# EAGLE design Addon-mapleCUx_HM-RFM69-012 (EAGLE 7.3.0)
MAPLE-CUx Large Version
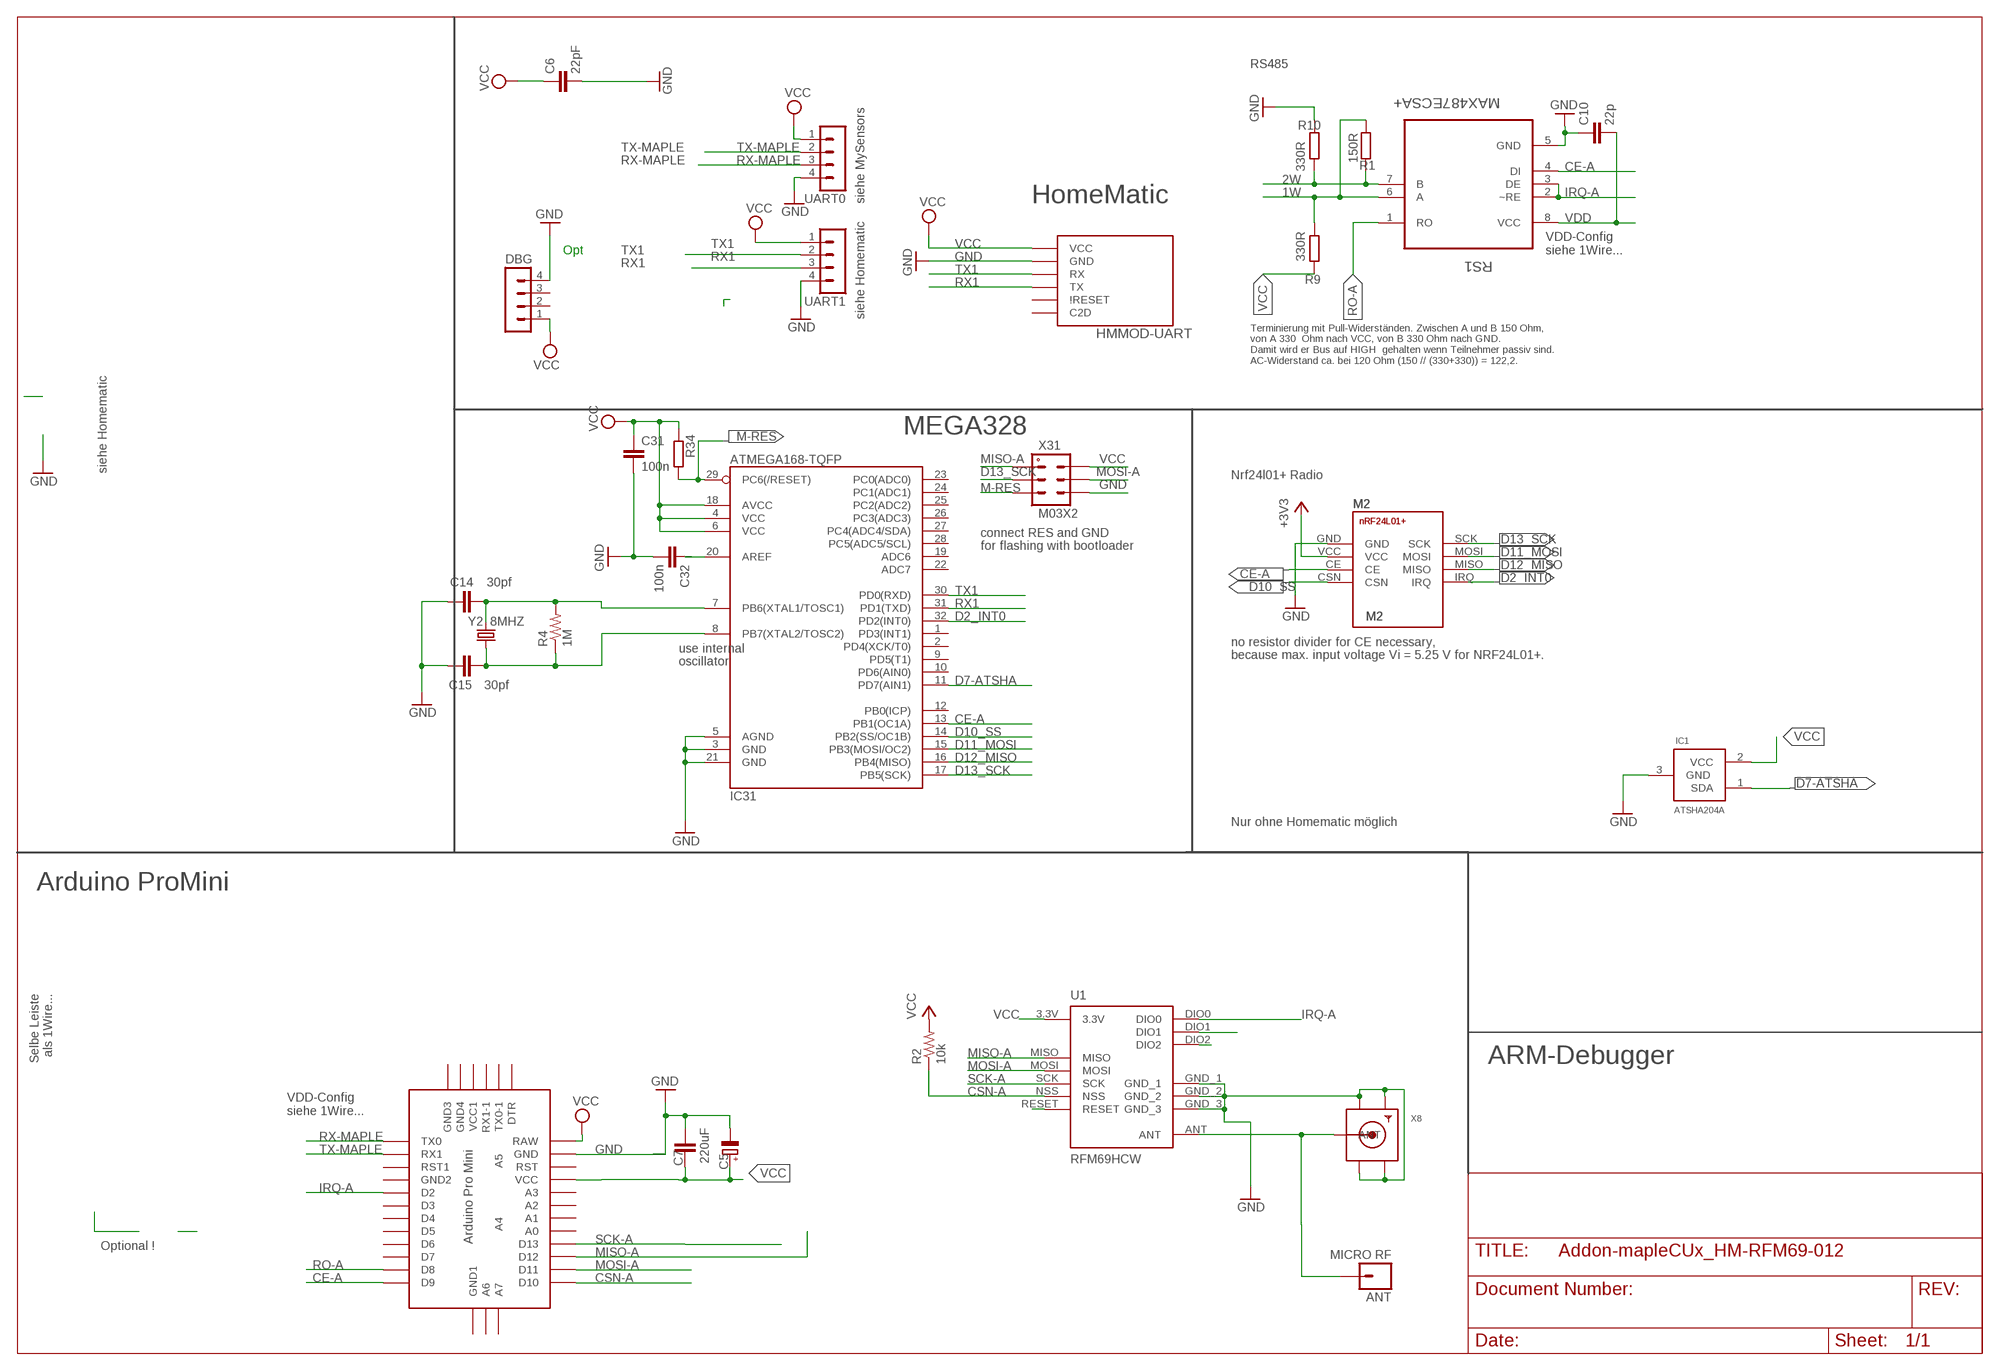
[diagram p0: schematic, sheet 1, part 1 of 2]
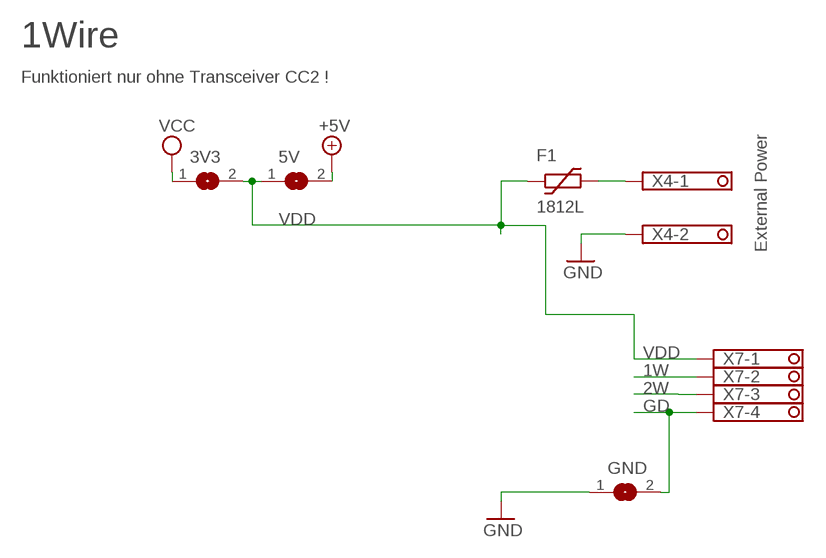
[diagram p1: schematic, sheet 1, part 2 of 2]

## Parts
3V3  SJ  [SJ]
5V  SJ  [SJ]
ANT  MICRO RF  M01PTH  [1X01]
C5  220uF  CPOL-EUE5-8.5  [E5-8,5]
C6  22pF  C-EUC0805  [C0805]
C7  C-EUC1812  [C1812]
C10  22p  C-EUC0805  [C0805]
C14  30pf  CAP0805  [0805]
C15  30pf  CAP0805  [0805]
C31  100n  C-EUC0805  [C0805]
C32  100n  C-EUC0805  [C0805]
DBG  MA04-1  [MA04-1]
F1  1812L  [1812L]
GND  SJ  [SJ]
HMMOD-UART  HM-MOD-UARTDIL  [HM-MOD-UART-DIL]
IC1  ATSHA204A  [SOT23]
IC31  ATMEGA168-TQFP  [TQFP32-08]
M2  NRF24L01+SMD  [NRF24L01+SMD]
R1  150R  R-EU_R0805  [R0805]
R2  10k  RESISTOR0805-RES  [0805]
R4  1M  RESISTOR0805-RES  [0805]
R9  330R  R-EU_R0805  [R0805]
R10  330R  R-EU_R0805  [R0805]
R34  R-EU_R0805  [R0805]
RS1  MAX487ECSA+  [SOIC127P600X175-8N]
U1  RFM69HCW  [RFM69HCW-XXXS2]
U$2  ABK-PRO-MINI  [ABK-PRO-MINI]
UART0  MA04-1  [MA04-1]
UART1  MA04-1  [MA04-1]
X4  1751248  [1751248]
X7  1751264  [1751264]
X8  SMACONNECTOR_EDGE  [SMA_EDGELAUNCH]
X31  M03X2  [2X03-1.27MM_SMD]
Y2  8MHZ  CRYSTALTXC-7A  [CRYSTAL-TXC-7A]

## Nets
1W: R1.1 R9.2 RS1.6(A) X7.2
2W: R1.2 R10.1 RS1.7(B) X7.3
3.3V [PWR]: M2.VCC ; supply symbol labelled +3V3
+5V [PWR]: 5V.2
ANT: ANT.1 U1.ANT X8.P(ANT)
CE-A: IC31.13(PB1(OC1A)) M2.CE RS1.4(DI) U$2.D9
CSN-A: R2.1 U1.NSS U$2.D10
D2_INT0: IC31.32(PD2(INT0)) M2.IRQ
D7-ATSHA: IC1.1(SDA) IC31.11(PD7(AIN1))
D10_SS: IC31.14(PB2(SS/OC1B)) M2.CSN
D11_MOSI: IC31.15(PB3(MOSI/OC2)) M2.MOSI
D12_MISO: IC31.16(PB4(MISO)) M2.MISO
D13_SCK: IC31.17(PB5(SCK)) M2.SCK X31.P$3
GD [PWR]: GND.2 X7.4
GND [PWR]: C5.- C6.2 C7.1 C10.1 C14.1 C15.1 C31.2 C32.2 DBG.4 GND.1 HMMOD-UART.2(GND) IC1.3(GND) IC31.3(GND) IC31.5(AGND) IC31.21(GND) M2.GND R10.2 RS1.5(GND) U1.GND_1 U1.GND_2 U1.GND_3 U$2.GND UART0.4 UART1.4 X4.2 X8.GND@1(GND4) X8.GND@2(GND3) X8.GND@3(GND2) X8.GND@4(GND1) X31.P$6
IRQ-A: RS1.2(~RE) RS1.3(DE) U1.DIO0 U$2.D2
M-RES: IC31.29(PC6(/RESET)) R34.2 X31.P$5
MISO-A: U1.MISO U$2.D12 X31.P$1
MOSI-A: U1.MOSI U$2.D11 X31.P$4
N$3: C14.2 IC31.7(PB6(XTAL1/TOSC1)) R4.2 Y2.P$2
N$13: C32.1 IC31.20(AREF)
N$14: U1.DIO2
N$15: U1.DIO1
N$16: U1.RESET
N$19: C15.2 IC31.8(PB7(XTAL2/TOSC2)) R4.1 Y2.P$1
N$45 [PWR]: F1.P$2 X4.1
RO-A: RS1.1(RO) U$2.D8
RX1: HMMOD-UART.5(TX) IC31.31(PD1(TXD)) UART1.3
RX-MAPLE: U$2.TX0 UART0.3
SCK-A: U1.SCK U$2.D13
TX1: HMMOD-UART.6(RX) IC31.30(PD0(RXD)) UART1.2
TX-MAPLE: U$2.RX1 UART0.2
VCC [PWR]: 3V3.1 C5.+ C6.1 C7.2 C31.1 DBG.1 HMMOD-UART.1(VCC) IC1.2(VCC) IC31.4(VCC) IC31.6(VCC) IC31.18(AVCC) R2.2 R9.1 R34.1 U1.3.3V U$2.RAW U$2.VCC UART0.1 UART1.1 X31.P$2
VDD [PWR]: 3V3.2 5V.1 C10.2 F1.P$1 RS1.8(VCC) X7.1
Unconnected: DBG.2 DBG.3 HMMOD-UART.3(C2D) HMMOD-UART.4(\!RESET) IC31.1(PD3(INT1)) IC31.2(PD4(XCK/T0)) IC31.9(PD5(T1)) IC31.10(PD6(AIN0)) IC31.12(PB0(ICP)) IC31.19(ADC6) IC31.22(ADC7) IC31.23(PC0(ADC0)) IC31.24(PC1(ADC1)) IC31.25(PC2(ADC2)) IC31.26(PC3(ADC3)) IC31.27(PC4(ADC4/SDA)) IC31.28(PC5(ADC5/SCL)) U$2.A0 U$2.A1 U$2.A2 U$2.A3 U$2.A4 U$2.A5 U$2.A6 U$2.A7 U$2.D3 U$2.D4 U$2.D5 U$2.D6 U$2.D7 U$2.DTR U$2.GND1(GND2) U$2.GND2(GND3) U$2.GND3(GND4) U$2.GND4(GND1) U$2.RST U$2.RST1 U$2.RX1-1 U$2.TX0-1 U$2.VCC1

## Notes on the sheet
- RS485
- 1Wire
- Funktioniert nur ohne Transceiver CC2 !
- siehe MySensors | HomeMatic
- External Power
- Opt
- VDD-Config
  siehe 1Wire...
- siehe Homematic
- Terminierung mit Pull-Widerständen. Zwischen A und B 150 Ohm,
  von A 330  Ohm nach VCC, von B 330 Ohm nach GND. 
  Damit wird er Bus auf HIGH  gehalten wenn Teilnehmer passiv sind.
  AC-Widerstand ca. bei 120 Ohm (150 // (330+330)) = 122,2.
- MEGA328
- siehe Homematic
- Nrf24l01+ Radio
- connect RES and GND
- for flashing with bootloader
- no resistor divider for CE necessary,
- use internal
- because max. input voltage Vi = 5.25 V for NRF24L01+.
- oscillator
- Nur ohne Homematic möglich
- Arduino ProMini
- Selbe Leiste
  als 1Wire...
- ARM-Debugger
- VDD-Config
  siehe 1Wire...
- Optional !

## Library data of the parts
3V3 5V GND = jumper:SJ: SMD solder JUMPER
ANT = SparkFun-Connectors:M01: Header 1 Standard 1-pin 0.1" header. Use with straight break away headers (SKU : PRT-00116), right angle break away headers (PRT-00553), swiss pins (PRT-00743), machine pins (PRT-00117), and female headers (PRT-00115).
C5 = rcl:CPOL-EU: POLARIZED CAPACITOR, European symbol
C6 C7 C10 C31 C32 = rcl:C-EU: CAPACITOR, European symbol
C14 C15 = doug:CAP: Capacitor Standard 0603 ceramic capacitor, and 0.1" leaded capacitor.
DBG UART0 UART1 = con-lstb:MA04-1: PIN HEADER; OC_FARNELL: unknown; OC_NEWARK: unknown
F1 = ptc-littlefuse:1812L
HMMOD-UART = wireless:HM-MOD-UART: eQ3 HM-MOD-UART-AW-SH2 wireless module for 868 MHz. DIL version for mounting with pin header (antenna upwards) and SMD variant available (antenna downwards).
IC1 = Sensor:ATSHA204A
IC31 = atmel:ATMEGA168: Atmel Atmega 168/328/328P
M2 = wireless:NRF24L01+: nRF24L01+ Transceiver Module
R1 R9 R10 R34 = rcl:R-EU_: RESISTOR, European symbol
R2 R4 = doug:RESISTOR: Resistor Basic schematic elements and footprints for 0603, 1206, and PTH resistors.
RS1 = Maxim_By_element14_Batch_1:MAX487ECSA+: Low-Power, Slew-Rate-Limited RS-485/RS-422 Transceivers; MPN: MAX487ECSA+; OC_FARNELL: 9724532; OC_NEWARK: 68K4803; PACKAGE: SOIC-8; SUPPLIER: Maxim
U1 = doug:RFM69H
U$2 = Arduino-clone:ABK-PRO-MINI: ABK Pro-Mini Arduino Clone
X4 = con-phoenix-350:1751248: MKDS 1/ 2-3,5 Printklemme Nennstrom: 10 A Bemessungsspannung: 160 V Raster: 3,5 mm Polzahl: 2 Montageart: Löten Anschlussart: Schraubanschluss Anschlussrichtung vom Leiter zur Platine: 0° Source: http://eshop.phoenixcontact.com .. 1751248.pdf; OC_FARNELL: unknown; OC_NEWARK: unknown
X7 = con-phoenix-350:1751264: MKDS 1/ 4-3,5 Printklemme Nennstrom: 10 A Bemessungsspannung: 160 V Raster: 3,5 mm Polzahl: 4 Montageart: Löten Anschlussart: Schraubanschluss Anschlussrichtung vom Leiter zur Platine: 0° Source: http://eshop.phoenixcontact.com .. 1751264.pdf; MPN: 1751264; OC_FARNELL: unknown; OC_NEWARK: 10R0934
X8 = adafruit:SMACONNECTOR: SMA Connector 90° DIP SMA Connector, 50 Ohm (4UConnector: 07259)
X31 = mechanics:M03X2
Y2 = SparkFun-FreqCtrl:CRYSTAL: Various standard crystals. Proven footprints.

## Net classes
0 default: width 0.305 mm
1 PWR: width 0.457 mm

## Board
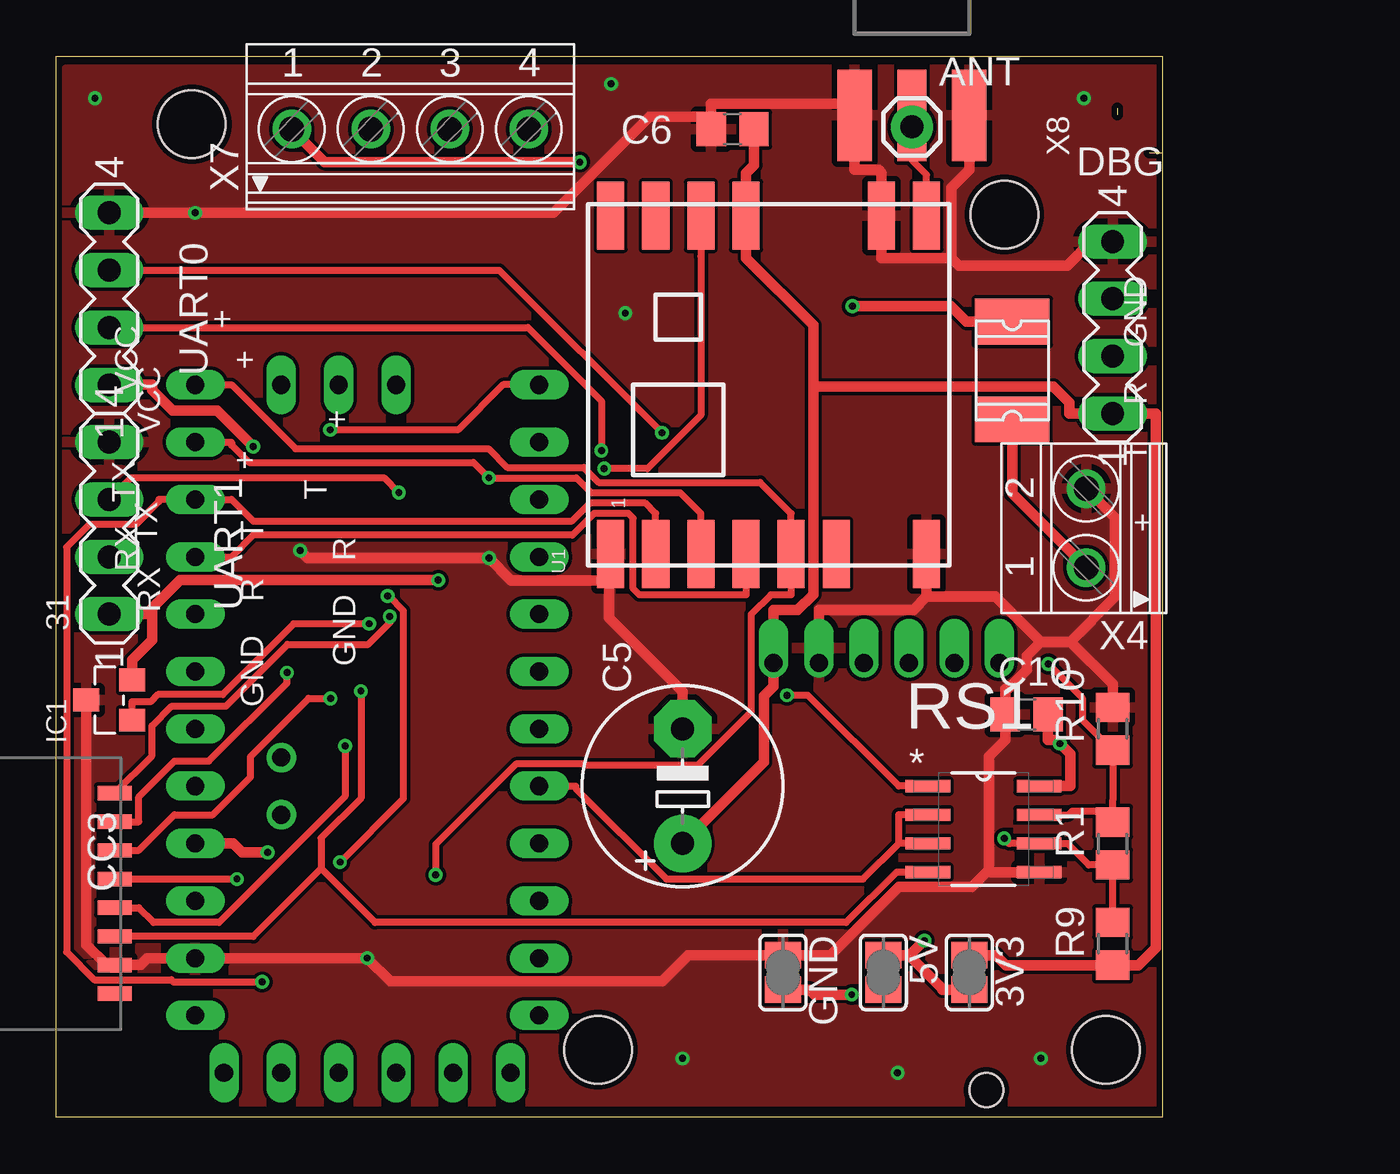
[diagram p2: board, top side]
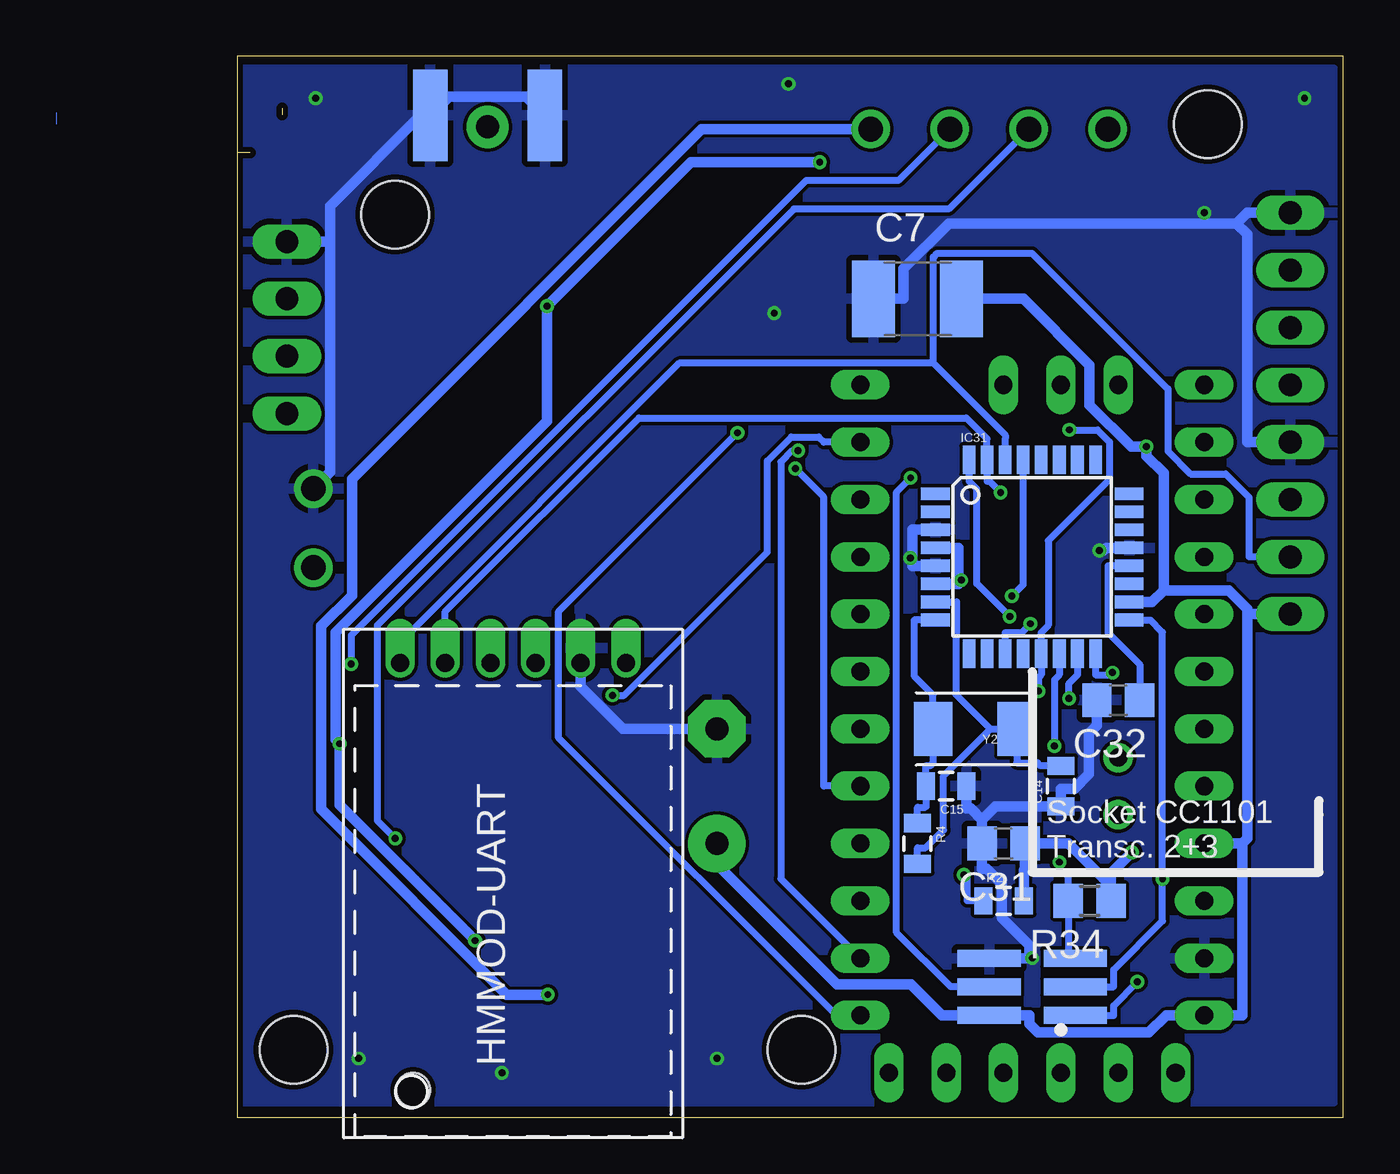
[diagram p3: board, bottom side, seen from below]

Size 49 x 47 mm. Coordinates in mm from the lower left corner, seen from the top.
Outline: 49,47 49,46.24
Outline: 47,44.7 47,44.41
Outline: 48.41,42.75 49,42.75
Outline: 49,47 0,47 0,0 49,0 49,42.75
Outline: 49,47 49,42.75
Copper layers (1*16): Top 0.035mm / dielectric 1.5mm / Bottom 0.035mm
Design rules "SeeedStudio_2layer_DRU_no_angle_20140221": minimum track width 6mil, minimum drill 12mil, track to track 6mil, track to pad 6mil, pad to pad 6mil, via to via 6mil, smd to smd 0mil, copper to edge 10mil, drill to drill 10mil, minimum pad ring 10mil, minimum via ring 6mil, stop-mask expansion 2mil, vias tented up to drill 100mil, thermal gap 10mil
Holes 3 mm at 42,40 6,44 24,3 46.5,3
Holes 1.5 mm at 41.2,1.21

### Footprints (pad centres in the part's own frame; a part is rotated, then mirrored left to right if it is on the bottom)
SJ = smd 1.168 x 1.6: 1 -0.762,0; 2 0.762,0
1X01 = drill 1.016 pad 1.88: 1 0,0
E5-8,5 = drill 1.016 pad 2.54: + -2.54,0 | drill 1.016 pad 2.54 octagon: - 2.54,0
C0805 = smd 1.3 x 1.5: 1 -0.95,0; 2 0.95,0
C1812 = smd 1.9 x 3.4: 1 -1.95,0; 2 1.95,0
0805 = smd 0.8 x 1.2: 1 -0.9,0; 2 0.9,0
MA04-1 = drill 1.016 long: 1 -3.81,0; 2 -1.27,0; 3 1.27,0; 4 3.81,0
1812L = smd 2.03 x 3.3: P$1 -2.16,0; P$2 2.16,0
HM-MOD-UART-DIL = drill 0.8 offset: 1 0,12; 2 0,10; 3 0,8; 4 0,6; 5 0,4; 6 0,2
SOT23 = smd 1.016 x 1.143: 1 -0.889,-1.016; 2 0.889,-1.016; 3 0,1.016
TQFP32-08 = smd 1.27 x 0.559: 1 -4.293,2.8; 2 -4.293,2; 3 -4.293,1.2; 4 -4.293,0.4; 5 -4.293,-0.4; 6 -4.293,-1.2; 7 -4.293,-2; 8 -4.293,-2.8; 17 4.293,-2.8; 18 4.293,-2; 19 4.293,-1.2; 20 4.293,-0.4; 21 4.293,0.4; 22 4.293,1.2; 23 4.293,2; 24 4.293,2.8 | smd 0.559 x 1.27: 9 -2.8,-4.293; 10 -2,-4.293; 11 -1.2,-4.293; 12 -0.4,-4.293; 13 0.4,-4.293; 14 1.2,-4.293; 15 2,-4.293; 16 2.8,-4.293; 25 2.8,4.293; 26 2,4.293; 27 1.2,4.293; 28 0.4,4.293; 29 -0.4,4.293; 30 -1.2,4.293; 31 -2,4.293; 32 -2.8,4.293
NRF24L01+SMD = smd 0.635 x 1.524: CE -1.575,-7.861; CSN -0.305,-7.861; GND -2.845,-7.861; IRQ 4.775,-7.861; MISO 3.505,-7.861; MOSI 2.235,-7.861; SCK 0.965,-7.861; VCC -4.115,-7.861
R0805 = smd 1.3 x 1.5: 1 -0.95,0; 2 0.95,0
SOIC127P600X175-8N = smd 1.981 x 0.533: 1 -2.464,1.905; 2 -2.464,0.635; 3 -2.464,-0.635; 4 -2.464,-1.905; 5 2.464,-1.905; 6 2.464,-0.635; 7 2.464,0.635; 8 2.464,1.905
RFM69HCW-XXXS2 = smd 3 x 1.2: 3.3V 7.5,1; ANT 7.5,-7; DIO0 7.5,3; DIO1 7.5,5; DIO2 7.5,7; GND_1 7.5,-5; GND_2 -7.5,-7; GND_3 -7.5,7; MISO -7.5,5; MOSI -7.5,3; NSS -7.5,-1; RESET -7.5,-3; SCK -7.5,1
ABK-PRO-MINI = drill 0.8 long: A0 10.16,-3.81; A1 10.16,-6.35; A2 10.16,-8.89; A3 10.16,-11.43; A6 3.81,-21.59; A7 6.35,-21.59; D2 -5.08,-3.81; D3 -5.08,-6.35; D4 -5.08,-8.89; D5 -5.08,-11.43; D6 -5.08,-13.97; D7 -5.08,-16.51; D8 -5.08,-19.05; D9 -5.08,-21.59; D10 10.16,-21.59; D11 10.16,-19.05; D12 10.16,-16.51; D13 10.16,-13.97; DTR 8.89,8.89; GND 10.16,3.81; GND1 -5.08,-1.27; GND2 -3.81,8.89; GND3 -1.27,8.89; GND4 1.27,-21.59; RAW 10.16,6.35; RST 10.16,1.27; RST1 -5.08,1.27; RX1 -5.08,3.81; RX1-1 3.81,8.89; TX0 -5.08,6.35; TX0-1 6.35,8.89; VCC 10.16,-1.27; VCC1 1.27,8.89 | drill 0.8: A4 6.35,-5.08; A5 6.35,-2.54
1751248 = drill 1.1 pad 1.7: 1 -1.75,-0.1; 2 1.75,-0.1
1751264 = drill 1.1 pad 1.7: 1 -5.25,-0.1; 2 -1.75,-0.1; 3 1.75,-0.1; 4 5.25,-0.1
SMA_EDGELAUNCH = smd 4.064 x 1.524: GND@1 2.032,-2.54; GND@2 2.032,2.54 | smd 4.064 x 1.524 bottom: GND@3 2.032,2.54; GND@4 2.032,-2.54 | smd 4.064 x 1.27: P 2.032,0
2X03-1.27MM_SMD = smd 0.75 x 2.8: P$1 -1.27,-1.905; P$2 -1.27,1.905; P$3 0,-1.905; P$4 0,1.905; P$5 1.27,-1.905; P$6 1.27,1.905
CRYSTAL-TXC-7A = smd 1.7 x 2.4: P$1 1.85,0; P$2 -1.85,0

### Placement (x,y rotation side)
3V3  40.44,6.41 270 top
5V  36.63,6.41 270 top
ANT  37.9,43.88 0 top
C5  27.74,14.67 90 top
C6  29.95,43.77 180 top
C7  18.85,36.26 0 bottom
C10  42.98,17.84 0 top
C14  12.5,14.67 90 bottom
C15  17.58,14.67 180 bottom
C31  15.04,12.13 180 bottom
C32  9.96,18.48 180 bottom
DBG  46.79,34.99 90 top
F1  42.34,33.09 270 top
GND  32.19,6.41 270 top
HMMOD-UART  43.77,20.13 270 bottom
IC1  2.34,18.48 90 top
IC31  13.77,24.83 0 bottom
M2  -5.28,9.59 90 top
R1  46.79,12.13 90 top
R2  15.04,9.59 0 bottom
R4  18.85,12.13 270 bottom
R9  46.79,7.68 90 top
R10  46.79,17.21 90 top
R34  11.23,9.59 180 bottom
RS1  41.08,12.77 0 top
U1  31.55,32.45 90 top
U$2  16.31,10.86 180 top
UART0  2.34,36.26 90 top
UART1  2.34,26.1 90 top
X4  45.52,26.1 90 top
X7  15.67,43.88 0 top
X8  37.9,46.42 270 top
X31  13.77,5.78 90 bottom
Y2  16.31,17.21 180 bottom

### Tracks (layer width: path | path; a pad name or v marks a point on that pad's centre or on a via)
1W  (via drill 0.3 pad 0.61)
  Top 0.305: v41.99,12.35 42.21,12.13 42.24,12.13 RS1.6 44.83,12.13 44.83,12.08 45.73,11.18 R1.1 R9.2
  Bottom 0.305: X7.2 17.47,40.24 24.33,40.24 42.78,21.79 42.78,13.15 v41.99,12.35
2W  (via drill 0.3 pad 0.61)
  Top 0.305: v43.94,20.08 45.44,18.59 45.44,17.61 R10.1 46.79,14.04 46.79,13.56 | RS1.7 44.83,13.4 44.99,13.56 46.79,13.56 | R1.2 46.79,13.56
  Bottom 0.305: X7.3 19.71,41.5 23.79,41.5 43.94,21.35 v43.94,20.08
ANT
  Top 0.305: U1.ANT 38.55,41.76 37.9,42.41 ANT.1 X8.P
CE-A  (via drill 0.3 pad 0.61)
  Top 0.305: v13.49,18.88 13.49,14.13 11.72,12.37 11.72,11.02 | U$2.D9 19.78,32.45 17.78,30.46 v12.12,30.46 | 11.72,11.02 14.12,8.62 34.98,8.62 37.22,10.86 37.32,10.86 RS1.4 | 11.72,11.02 8.72,8.02 M2.CE
  Bottom 0.305: v12.12,30.46 10.88,30.46 10.35,29.92 10.35,28.25 13.06,25.54 13.06,21.79 13.37,21.48 IC31.13 13.37,19.6 13.49,19.48 v13.49,18.88
CSN-A  (via drill 0.3 pad 0.61)
  Top 0.305: U$2.D10 7.76,32.45 10.59,29.62 19.14,29.62 19.97,28.79 23.36,28.79 24.02,28.13 31.18,28.13 32.55,26.76 U1.NSS 32.55,24.05 32.55,23.15 31.64,23.15 30.78,22.28 30.78,17.96 28.41,15.59 23.48,15.59 23.42,15.65 20.36,15.65 16.8,12.09 v16.8,10.74
  Bottom 0.305: v16.8,10.74 16.64,10.58 16.64,9.59 R2.1
D2_INT0  (via drill 0.3 pad 0.61)
  Top 0.305: M2.IRQ 4.23,16.02 4.23,17.35 5.11,18.22 7.51,18.22 10.24,20.95 13.81,20.95 14.77,21.91 v14.77,22.19
  Bottom 0.305: IC31.32 16.57,28.18 16.23,27.84 16.23,23.65 v14.77,22.19
D7-ATSHA  (via drill 0.3 pad 0.61)
  Top 0.305: IC1.1 3.36,18.4 4.17,18.4 4.49,18.73 7.37,18.73 10.51,21.86 v13.85,21.86
  Bottom 0.305: IC31.11 14.97,21.48 14.24,21.48 v13.85,21.86
D10_SS  (via drill 0.3 pad 0.61)
  Top 0.305: v12.78,16.45 12.78,14.21 7.2,8.62 4.31,8.62 3.65,9.29 M2.CSN
  Bottom 0.305: v12.78,16.45 12.78,19.38 12.57,19.6 IC31.14
D11_MOSI  (via drill 0.3 pad 0.61)
  Top 0.305: M2.MOSI 3.65,11.82 5.22,13.4 6.93,13.4 8.6,15.07 8.6,15.99 11.17,18.56 v12.14,18.56 | v12.14,18.56
  Bottom 0.305: IC31.15 11.77,19.6 12.14,19.23 v12.14,18.56
D12_MISO  (via drill 0.3 pad 0.61)
  Top 0.305: M2.MISO 3.65,13.09 3.65,14.2 5.23,15.78 6.75,15.78 10.21,19.24 v10.21,19.7 | v10.21,19.7
  Bottom 0.305: IC31.16 10.97,19.6 10.31,19.6 v10.21,19.7
D13_SCK  (via drill 0.3 pad 0.61)
  Top 0.305: M2.SCK v8,10.55
  Bottom 0.305: IC31.17 8.54,22.03 8,21.49 v8,10.55 8,8.7 10.16,6.54 10.16,5.78 X31.P$3
GD  (via drill 0.3 pad 0.61)
  Top 0.457: GND.2 33.37,5.65 33.58,5.43 v35.23,5.43
  Bottom 0.457: X7.4 28.42,43.78 43.91,28.29 43.91,23.12 45.27,21.76 45.27,13.65 37.05,5.43 v35.23,5.43
GND  (via drill 0.3 pad 0.61)
  Top 0.457: HMMOD-UART.2 33.77,22.47 37.95,22.47 38.55,23.07 | U1.GND_2 38.55,23.07 | 43.61,21.06 41.61,23.07 38.55,23.07 | 43.61,21.06 44.92,21.06 | 43.61,21.06 42.99,20.44 42.99,19.82 42.15,18.98 42.03,18.98 C10.1 42.03,16.71 41.3,15.99 41.3,10.95 | 24.49,23.79 20.14,23.79 v19.16,24.77 11.13,24.77 v10.8,25.11 | U1.GND_3 24.55,23.85 24.49,23.79 | 24.49,23.79 24.49,22.11 27.74,18.86 C5.- | 44.92,21.06 46.79,19.19 R10.2 | X4.2 46.89,26.58 46.89,23.04 44.92,21.06 | 41.3,10.95 41.39,10.86 42.17,10.86 RS1.5 | 41.3,10.95 40.56,10.21 37.33,10.21 34.29,7.18 GND.1 27.99,7.18 26.83,6.01 14.81,6.01 v13.77,7.05 7.84,7.05 U$2.GND 4.03,7.05 3.72,6.75 M2.GND 2.22,6.75 1.32,7.64 IC1.3 | 29,44.34 26.28,44.34 22.02,40.07 UART0.4 | 29,44.34 29,44.9 34.85,44.9 X8.GND@1 35.36,41.98 36.41,41.98 36.55,41.83 U1.GND_1 36.55,38.07 39.65,38.07 | C6.2 29,44.34 | 39.65,38.07 39.65,41.18 40.44,41.98 X8.GND@2 | 39.65,38.07 39.98,37.74 44.78,37.74 45.84,38.8 DBG.4
  Bottom 0.457: IC31.3 19.08,26.03 19.08,24.85 v19.16,24.77 19.08,24.69 19.08,24.43 IC31.5 | IC31.21 10.49,25.23 10.61,25.11 v10.8,25.11 | 44.89,38.8 44.89,40.36 40.86,44.39 X8.GND@2 39.61,45.22 36.19,45.22 X8.GND@1 | DBG.4 44.89,38.8 | X4.2 44.89,28.59 44.89,38.8 | C7.1 19.47,36.26 19.47,37.59 17.46,39.6 4.72,39.6 | 13.89,7.05 v13.77,7.05 | X31.P$6 13.89,7.05 | 13.89,7.05 13.89,7.62 15.12,8.84 15.12,10.35 15.77,11 15.99,11 C31.2 15.99,13.18 | C32.2 10.91,17.35 11.26,17 11.26,15.21 11.91,14.55 12.5,14.55 C14.1 15.41,13.77 15.99,13.18 | UART1.4 4.24,29.91 4.24,39.12 4.72,39.6 | 4.72,39.6 4.24,40.07 UART0.4 | C5.- 31.89,17.21 33.77,19.1 HMMOD-UART.2 | C15.1 16.68,13.69 16.49,13.69 15.99,13.18
  other vias: 27.74,2.61 37.27,1.97 43.61,2.61 25.2,35.62 1.7,45.15 6.15,40.07 24.56,45.78 45.52,45.15
  pour Bottom: 0.44,0.7 0.44,46.42 48.69,46.42 48.69,0.7
  pour Top: 0.44,0.7 0.44,46.42 48.69,46.42 48.69,0.7
IRQ-A  (via drill 0.3 pad 0.61)
  Top 0.305: 37.32,12.13 35.74,10.55 27.03,10.55 23,14.57 23,14.67 U$2.D2 | 37.32,12.13 37.32,13.4 RS1.2 | RS1.3 37.32,12.13 | v24.27,28.74 26.18,28.74 28.55,31.11 28.55,38.15 U1.DIO0
  Bottom 0.305: U$2.D2 23,14.67 23,27.47 v24.27,28.74
M-RES  (via drill 0.3 pad 0.61)
  Top 0.305: v12.56,11.3 15.38,14.12 15.38,22.44 14.73,23.09 v14.67,23.09
  Bottom 0.305: v12.56,11.3 12.56,11.03 12.18,10.64 R34.2 12.18,7.36 X31.P$5 | v14.67,23.09 14.17,23.59 IC31.29
MISO-A  (via drill 0.3 pad 0.61)
  Top 0.305: v9.11,6 5.19,6 5.09,6.1 1.67,6.1 0.45,7.32 0.45,25.25 1.46,26.27 3.53,26.27 4.54,27.27 4.54,27.37 U$2.D12 7.76,27.37 8.74,26.4 22.82,26.4 23.63,27.21 26.09,27.21 26.55,26.76 U1.MISO
  Bottom 0.305: X31.P$1 10.16,4.51 10.16,4.95 v9.11,6
MOSI-A  (via drill 0.3 pad 0.61)
  Top 0.305: U$2.D11 7.76,29.91 7.76,29.78 8.53,29.01 18.47,29.01 v19.16,28.33 23.03,28.33 23.69,27.67 27.64,27.67 28.55,26.76 U1.MOSI
  Bottom 0.305: X31.P$4 17.38,5.78 19.78,8.18 19.78,27.71 v19.16,28.33
N$3
  Bottom 0.305: IC31.7 17.12,22.83 17.12,21.48 17.15,21.45 17.15,18.74 15.62,17.21 | 15.62,17.21 Y2.P$2 14.46,15.7 13.54,15.7 13.41,15.57 C14.2 | 15.62,17.21 17.7,15.13 17.7,12.73 18.5,11.93 18.85,11.93 R4.2
N$5
  Bottom 0: 57,44.5 57,44
N$13
  Bottom 0.305: IC31.20 10.42,24.43 10.42,21.48 9.01,20.07 C32.1
N$19
  Bottom 0.305: R4.1 18.85,13.73 18.51,13.73 18.48,13.77 C15.2 18.48,15.57 18.29,15.57 18.16,15.7 Y2.P$1 18.16,18.71 19,19.56 19,22.03 IC31.8
N$45
  Top 0.457: X4.1 42.34,27.62 F1.P$2
RO-A  (via drill 0.3 pad 0.61)
  Top 0.305: v32.36,18.7 33.29,18.7 37.32,14.67 RS1.1
  Bottom 0.305: v32.36,18.7 31.85,18.7 25.51,25.03 25.51,29.08 24.44,30.14 23.24,30.14 23,29.91 U$2.D8
RX1  (via drill 0.3 pad 0.61)
  Top 0.305: UART1.3 3.3,28.34 14.51,28.34 v15.17,27.68
  Bottom 0.305: v15.17,27.68 15.67,28.18 15.77,28.18 IC31.31 15.77,30.06 16.69,30.98 31.19,30.98 39.77,22.4 HMMOD-UART.5
RX-MAPLE  (via drill 0.3 pad 0.61)
  Top 0.305: UART0.3 19.62,37.53 v26.83,30.33
  Bottom 0.305: v26.83,30.33 34.78,22.38 34.78,16.83 22.45,4.51 U$2.TX0
SCK-A
  Top 0.305: U$2.D13 7.76,24.83 8.72,25.79 22.86,25.79 23.82,26.76 25.34,26.76 25.55,26.55 25.55,23.42 25.82,23.15 30.55,23.15 U1.SCK
TX1
  Bottom 0.305: 18.16,33.41 14.97,30.23 14.97,30.06 IC31.30 | 18.16,33.41 29.41,33.41 41.77,21.05 HMMOD-UART.6 | 18.16,33.41 18.16,38.11 17.98,38.28 13.78,38.28 7.76,32.27 7.76,29.51 6.76,28.5 5.2,28.5 4.17,27.47 4.17,24.83 UART1.2
TX-MAPLE  (via drill 0.3 pad 0.61)
  Top 0.305: UART0.2 20.89,34.99 24.14,31.73 v24.14,29.53
  Bottom 0.305: v24.14,29.53 24.41,29.53 24.9,29.04 24.9,10.56 U$2.RX1
VCC  (via drill 0.3 pad 0.61)
  Top 0.457: v8.72,29.72 7.12,31.31 5.15,31.31 4.24,32.21 4.24,32.45 UART0.1 | C5.+ 31.34,15.73 31.34,18.67 31.77,19.1 HMMOD-UART.1 31.77,22.47 32.83,22.47 33.53,23.17 33.53,32.37 | 33.53,32.37 33.53,35.09 30.55,38.07 U1.3.3V 30.55,41.83 30.91,42.19 C6.1 | 33.53,32.37 44.17,32.37 44.89,31.65 44.89,31.18 DBG.1 48.69,31.18 48.69,7.51 47.92,6.73 R9.1 42.06,6.73 41.62,7.18 3V3.1 | U$2.VCC 7.84,12.13 8.23,11.73 v9.35,11.73 | 4.24,22.29 4.24,22.55 5.49,23.8 v16.92,23.8 | IC1.2 3.36,20.26 4.24,21.15 4.24,22.29 | UART1.1 4.24,22.29
  Bottom 0.457: C5.+ 27.74,11.2 22.42,5.89 19.14,5.89 17.76,4.51 X31.P$2 13.89,4.51 13.89,4.13 13.52,3.75 8.59,3.75 7.84,4.51 U$2.RAW 4.46,4.51 4.46,12.13 | C7.2 14.16,36.26 11.23,33.33 11.23,31.56 9.39,29.72 v8.72,29.72 8.72,29.3 7.95,28.53 7.95,23.34 | 7.95,23.34 8.46,22.83 IC31.18 | 4.24,22.29 4.24,22.53 5.06,23.34 7.95,23.34 | 4.46,12.13 4.24,12.35 4.24,22.29 | 4.46,12.13 4.61,12.13 U$2.VCC | UART1.1 4.24,22.29 | v9.35,11.73 10.28,10.81 10.28,10.25 | 10.28,10.25 12.16,12.13 C31.1 14.09,11 14.14,10.95 R2.2 | R34.1 10.28,10.25 | 17.05,23.8 v16.92,23.8 | 17.05,23.8 17.05,25.23 IC31.4 | 17.05,23.8 17.05,23.63 IC31.6
VDD  (via drill 0.3 pad 0.61)
  Top 0.457: 3V3.2 39.26,5.65 39.26,5.69 37.77,7.18 | 37.77,7.18 37.81,7.18 37.81,7.19 v38.45,7.83 | 5V.1 37.22,7.18 37.77,7.18 | RS1.8 44.91,14.67 44.91,16.1 v44.45,16.55 44.29,16.71 43.93,16.71 C10.2 | X7.1 11.88,42.32 v23.18,42.32 | F1.P$1 40.31,35.24 39.62,35.93 v35.26,35.93
  Bottom 0.457: v23.18,42.32 28.88,42.32 v35.26,35.93 35.26,30.85 44.63,21.49 44.63,16.73 v44.45,16.55 44.45,13.83 v38.45,7.83

### Text on the board
tNames: + | GND | + | VCC | R | VCC | + | + | T | T | TX | + | T | R | TX | RX | R | 31 | GND | RX | GND | CC3
bNames: Socket CC1101 / Transc. 2+3